# Altium schematic sheet FPGA_Power.SchDoc: FPGA Power Banks
size B; CheckedBy: Jason Sullins; Author: Jordan Harris-Toovy; Revision: 0.2; SheetNumber: 16; SheetTotal: 22; Size: ANSI B
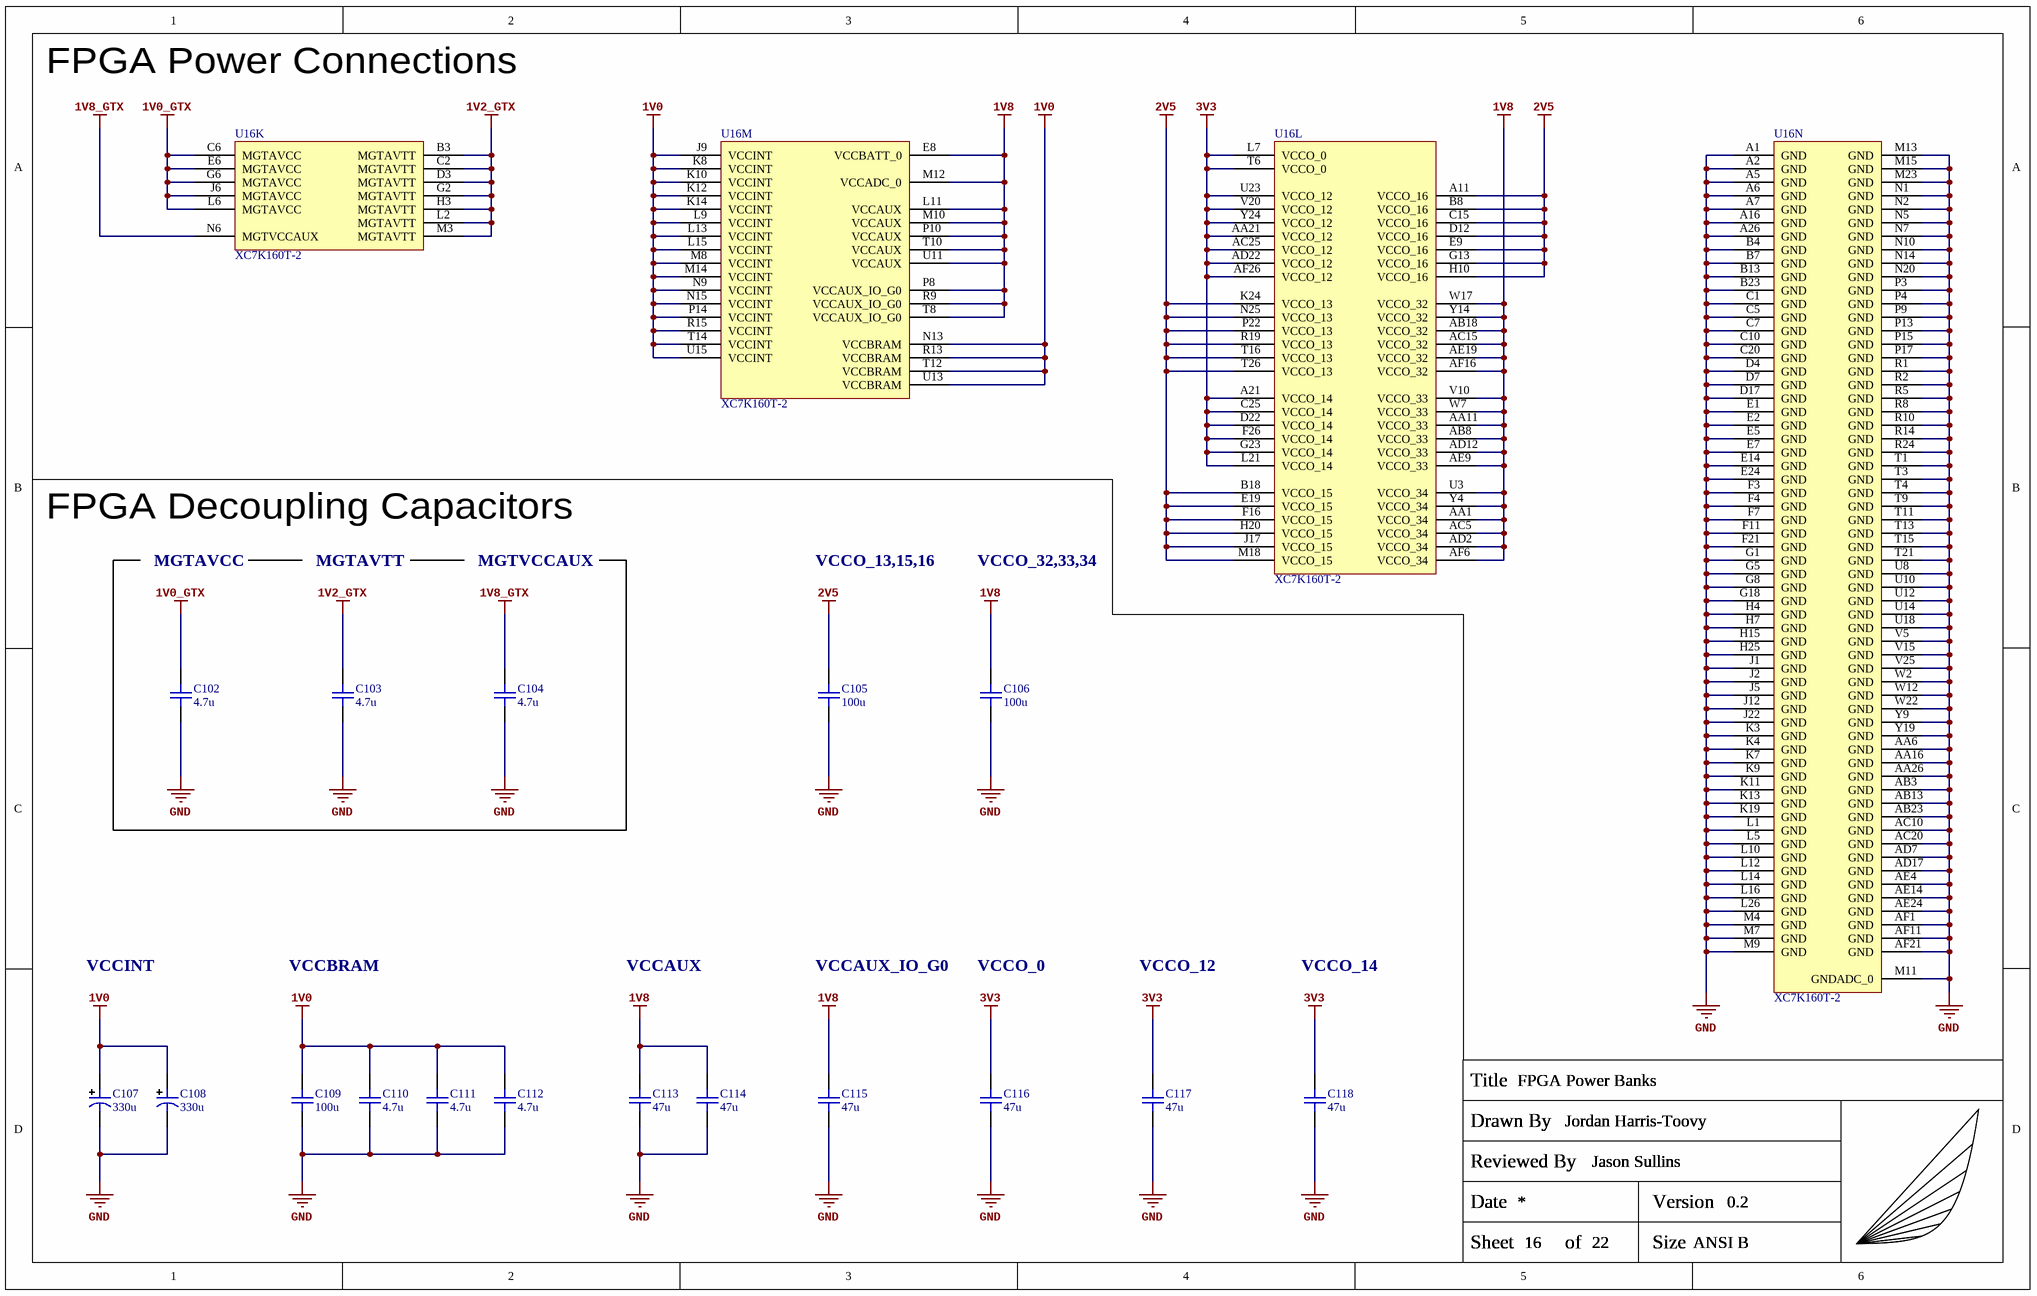
[diagram p0: FPGA_Power.SchDoc]

## Parts
C102  4.7u  [C_0402_Generic]
C103  4.7u  [C_0402_Generic]
C104  4.7u  [C_0402_Generic]
C105  100u  [C_0805_Generic]
C106  100u  [C_0805_Generic]
C107  330u  [C_TANT_EIA-3528-21_B]
C108  330u  [C_TANT_EIA-3528-21_B]
C109  100u  [C_0805_Generic]
C110  4.7u  [C_0402_Generic]
C111  4.7u  [C_0402_Generic]
C112  4.7u  [C_0402_Generic]
C113  47u  [C_0603_Generic]
C114  47u  [C_0603_Generic]
C115  47u  [C_0603_Generic]
C116  47u  [C_0603_Generic]
C117  47u  [C_0603_Generic]
C118  47u  [C_0603_Generic]
TITLEBLOCK?  Capstone_Title_Block  (value not drawn)  (graphical)
U16  XC7K160T-2  [FFG676_(XC7K160T-2FFG676I)]  (parts K,L,M,N of 14)

## Nets
1V0: C107.1 C108.1 C109.2 C110.2 C111.2 C112.2 U16.J9(VCCINT) U16.K8(VCCINT) U16.K10(VCCINT) U16.K12(VCCINT) U16.K14(VCCINT) U16.L9(VCCINT) U16.L13(VCCINT) U16.L15(VCCINT) U16.M8(VCCINT) U16.M14(VCCINT) U16.N9(VCCINT) U16.N13(VCCBRAM) U16.N15(VCCINT) U16.P14(VCCINT) U16.R13(VCCBRAM) U16.R15(VCCINT) U16.T12(VCCBRAM) U16.T14(VCCINT) U16.U13(VCCBRAM) U16.U15(VCCINT)
1V0_GTX: C102.2 U16.C6(MGTAVCC) U16.E6(MGTAVCC) U16.G6(MGTAVCC) U16.J6(MGTAVCC) U16.L6(MGTAVCC)
1V2_GTX: C103.2 U16.B3(MGTAVTT) U16.C2(MGTAVTT) U16.D3(MGTAVTT) U16.G2(MGTAVTT) U16.H3(MGTAVTT) U16.L2(MGTAVTT) U16.M3(MGTAVTT)
1V8: C106.2 C113.2 C114.2 C115.2 U16.AA1(VCCO_34) U16.AA11(VCCO_33) U16.AB8(VCCO_33) U16.AB18(VCCO_32) U16.AC5(VCCO_34) U16.AC15(VCCO_32) U16.AD2(VCCO_34) U16.AD12(VCCO_33) U16.AE9(VCCO_33) U16.AE19(VCCO_32) U16.AF6(VCCO_34) U16.AF16(VCCO_32) U16.E8(VCCBATT_0) U16.L11(VCCAUX) U16.M10(VCCAUX) U16.M12(VCCADC_0) U16.P8(VCCAUX_IO_G0) U16.P10(VCCAUX) U16.R9(VCCAUX_IO_G0) U16.T8(VCCAUX_IO_G0) U16.T10(VCCAUX) U16.U3(VCCO_34) U16.U11(VCCAUX) U16.V10(VCCO_33) U16.W7(VCCO_33) U16.W17(VCCO_32) U16.Y4(VCCO_34) U16.Y14(VCCO_32)
1V8_GTX: C104.2 U16.N6(MGTVCCAUX)
2V5: C105.2 U16.A11(VCCO_16) U16.B8(VCCO_16) U16.B18(VCCO_15) U16.C15(VCCO_16) U16.D12(VCCO_16) U16.E9(VCCO_16) U16.E19(VCCO_15) U16.F16(VCCO_15) U16.G13(VCCO_16) U16.H10(VCCO_16) U16.H20(VCCO_15) U16.J17(VCCO_15) U16.K24(VCCO_13) U16.M18(VCCO_15) U16.N25(VCCO_13) U16.P22(VCCO_13) U16.R19(VCCO_13) U16.T16(VCCO_13) U16.T26(VCCO_13)
3V3: C116.2 C117.2 C118.2 U16.A21(VCCO_14) U16.AA21(VCCO_12) U16.AC25(VCCO_12) U16.AD22(VCCO_12) U16.AF26(VCCO_12) U16.C25(VCCO_14) U16.D22(VCCO_14) U16.F26(VCCO_14) U16.G23(VCCO_14) U16.L7(VCCO_0) U16.L21(VCCO_14) U16.T6(VCCO_0) U16.U23(VCCO_12) U16.V20(VCCO_12) U16.Y24(VCCO_12)
GND: C102.1 C103.1 C104.1 C105.1 C106.1 C107.2 C108.2 C109.1 C110.1 C111.1 C112.1 C113.1 C114.1 C115.1 C116.1 C117.1 C118.1 U16.A1(GND) U16.A2(GND) U16.A5(GND) U16.A6(GND) U16.A7(GND) U16.A16(GND) U16.A26(GND) U16.AA6(GND) U16.AA16(GND) U16.AA26(GND) U16.AB3(GND) U16.AB13(GND) U16.AB23(GND) U16.AC10(GND) U16.AC20(GND) U16.AD7(GND) U16.AD17(GND) U16.AE4(GND) U16.AE14(GND) U16.AE24(GND) U16.AF1(GND) U16.AF11(GND) U16.AF21(GND) U16.B4(GND) U16.B7(GND) U16.B13(GND) U16.B23(GND) U16.C1(GND) U16.C5(GND) U16.C7(GND) U16.C10(GND) U16.C20(GND) U16.D4(GND) U16.D7(GND) U16.D17(GND) U16.E1(GND) U16.E2(GND) U16.E5(GND) U16.E7(GND) U16.E14(GND) U16.E24(GND) U16.F3(GND) U16.F4(GND) U16.F7(GND) U16.F11(GND) U16.F21(GND) U16.G1(GND) U16.G5(GND) U16.G8(GND) U16.G18(GND) U16.H4(GND) U16.H7(GND) U16.H15(GND) U16.H25(GND) U16.J1(GND) U16.J2(GND) U16.J5(GND) U16.J12(GND) U16.J22(GND) U16.K3(GND) U16.K4(GND) U16.K7(GND) U16.K9(GND) U16.K11(GND) U16.K13(GND) U16.K19(GND) U16.L1(GND) U16.L5(GND) U16.L10(GND) U16.L12(GND) U16.L14(GND) U16.L16(GND) U16.L26(GND) U16.M4(GND) U16.M7(GND) U16.M9(GND) U16.M11(GNDADC_0) U16.M13(GND) U16.M15(GND) U16.M23(GND) U16.N1(GND) U16.N2(GND) U16.N5(GND) U16.N7(GND) U16.N10(GND) U16.N14(GND) U16.N20(GND) U16.P3(GND) U16.P4(GND) U16.P9(GND) U16.P13(GND) U16.P15(GND) U16.P17(GND) U16.R1(GND) U16.R2(GND) U16.R5(GND) U16.R8(GND) U16.R10(GND) U16.R14(GND) U16.R24(GND) U16.T1(GND) U16.T3(GND) U16.T4(GND) U16.T9(GND) U16.T11(GND) U16.T13(GND) U16.T15(GND) U16.T21(GND) U16.U8(GND) U16.U10(GND) U16.U12(GND) U16.U14(GND) U16.U18(GND) U16.V5(GND) U16.V15(GND) U16.V25(GND) U16.W2(GND) U16.W12(GND) U16.W22(GND) U16.Y9(GND) U16.Y19(GND)

## Notes on the sheet
- FPGA Power Connections
- FPGA Decoupling Capacitors
- MGTAVCC
- MGTAVTT
- MGTVCCAUX
- VCCO_13,15,16
- VCCO_32,33,34
- VCCINT
- VCCBRAM
- VCCAUX
- VCCAUX_IO_G0
- VCCO_0
- VCCO_12
- VCCO_14
- (in symbol Capstone_Title_Block) Title; Drawn By; Reviewed By; Date; Version; Sheet; of; Size

## Library data of the parts
C102-C104 C110-C112 = GRM155R61A475MEAAJ: 4.7µF 10V X5R SMD ceramic capacitor in 0402 size; Manufacturer: Murata Electronics; Manufacturer Part Number: GRM155R61A475MEAAJ
C105 C106 C109 = GRM21BR60J107ME15L: 100µF 6.3V X5R SMD ceramic capacitor in 0805 size; Manufacturer: Murata Electronics; Manufacturer Part Number: GRM21BR60J107ME15L
C107 C108 = T520B337M2R5ATE015: 330µF 2.5V 15mOhm SMD tantalum capacitor in EIA-3528-21size; Manufacturer: KEMET; Manufacturer Part Number: T520B337M2R5ATE015
C113-C118 = GRM188R60J476ME15D: 47µF 6.3V X5R SMD ceramic capacitor in 0603 size; Manufacturer: Murata Electronics; Manufacturer Part Number: GRM188R60J476ME15D
TITLEBLOCK? = Capstone_Title_Block: Custom title block with personal logo; Manufacturer: NONE; Manufacturer Part Number: NONE
U16 = XC7K160T-2FFG676I: Kintex-7 FPGA, 400 User I/Os, 8 GTX, 676-Ball BGA, Speed Grade 2, Industrial Grade, Pb-Free; Manufacturer: AMD/Xilinx; Manufacturer Part Number: XC7K160T-2FFG676I